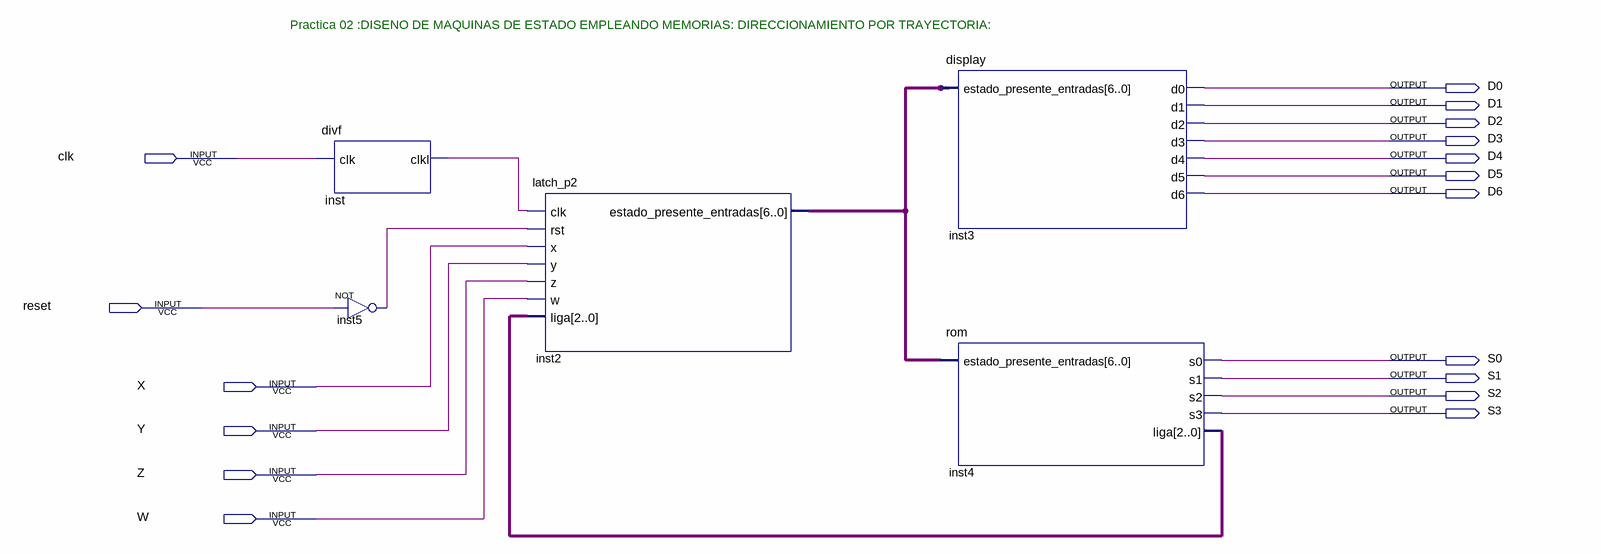
[diagram p0: schematic sheet]
// Quartus schematic Practica02OyAC.bdf as structural Verilog: 5 symbols, 17 pins
module Practica02OyAC (
  input  clk,
  input  reset,
  input  X,
  input  Y,
  input  Z,
  input  W,
  output D0,
  output D1,
  output D2,
  output D3,
  output D4,
  output D5,
  output D6,
  output S0,
  output S1,
  output S2,
  output S3
);

  wire inst5_out, inst_clkl;
  wire [2:0] inst4_liga;
  wire [6:0] inst2_estado_presente_entradas;

  divf inst (.clk(clk), .clkl(inst_clkl));
  not inst5 (inst5_out, reset);
  latch_p2 inst2 (
    .clk(inst_clkl), .rst(inst5_out), .x(X), .y(Y), .z(Z), .w(W), .liga(inst4_liga),
    .estado_presente_entradas(inst2_estado_presente_entradas));
  display inst3 (
    .estado_presente_entradas(inst2_estado_presente_entradas), .d0(D0), .d1(D1), .d2(D2), .d3(D3), .d4(D4),
    .d5(D5), .d6(D6));
  rom inst4 (
    .estado_presente_entradas(inst2_estado_presente_entradas), .s0(S0), .s1(S1), .s2(S2), .s3(S3),
    .liga(inst4_liga));

  // Notes on the sheet:
  //   Practica 02 :DISENO DE MAQUINAS DE ESTADO EMPLEANDO MEMORIAS: DIRECCIONAMIENTO POR TRAYECTORIA:
endmodule
